# EAGLE design Modul1 (EAGLE 9.6.2)
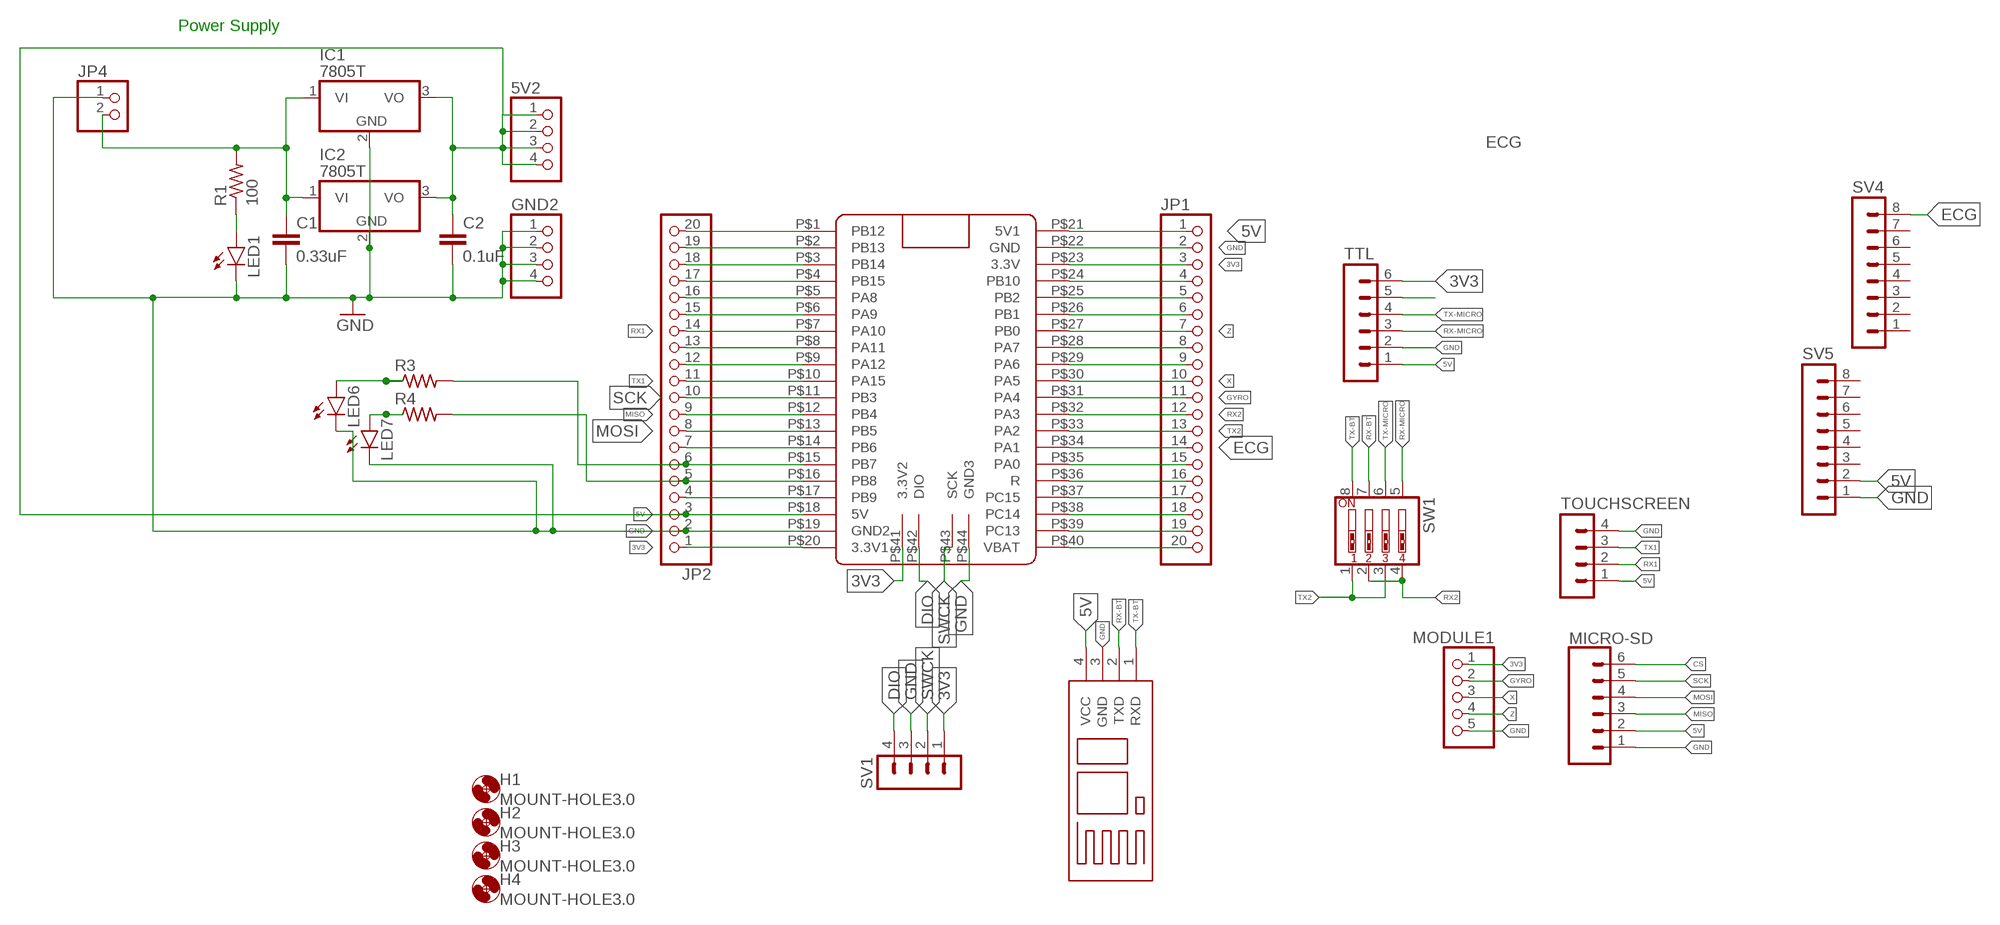
[diagram p0: schematic, sheet 1]

## Parts
5V2  PINHD-1X4  [1X04]
B3  BLUETOOTH  [BLUETOOTH]
C1  0.33uF  C-EU025-024X044  [C025-024X044]
C2  0.1uF  C-EU025-024X044  [C025-024X044]
GND2  PINHD-1X4  [1X04]
H1  MOUNT-HOLE3.0  [3,0]
H2  MOUNT-HOLE3.0  [3,0]
H3  MOUNT-HOLE3.0  [3,0]
H4  MOUNT-HOLE3.0  [3,0]
IC1  7805T  [TO220H]
IC2  7805T  [TO220H]
JP1  PINHD-1X20  [1X20]
JP2  PINHD-1X20  [1X20]
JP4  PINHD-1X2  [1X02]
LED1  LED5MM  [LED5MM]
LED6  LED5MM  [LED5MM]
LED7  LED5MM  [LED5MM]
MICRO-SD  CONN_06SILK_FEMALE_PTH  [1X06@1]
MODULE1  PINHD-1X5  [1X05]
R1  100  R-US_0204/5  [0204/5]
R3  R-US_0204/5  [0204/5]
R4  R-US_0204/5  [0204/5]
SV1  MA04-1  [MA04-1]
SV4  MA08-1  [MA08-1]
SV5  MA08-1  [MA08-1]
SW1  SW_DIP-4  [EDG-04]
TOUCHSCREEN  MA04-1  [MA04-1]
TTL  MA06-1  [MA06-1]
U$1  BLACKPILL  [BLACKPILL]

## Nets
3V3: JP1.3 JP2.1 MODULE1.1 SV1.1 TTL.6 U$1.P$20(3.3V1) U$1.P$23(3.3V) U$1.P$41(3.3V2)
5V: 5V2.1 5V2.2 5V2.3 5V2.4 B3.4(VCC) C2.1 IC1.3(VO) IC2.3(VO) JP1.1 JP2.3 MICRO-SD.2 SV5.2 TOUCHSCREEN.1 TTL.1 U$1.P$18(5V) U$1.P$21(5V1)
CS: MICRO-SD.6
DIO: SV1.4 U$1.P$42(DIO)
ECG: JP1.14 SV4.8 U$1.P$34(PA1)
GND: C1.2 C2.2 GND2.1 GND2.2 GND2.3 GND2.4 IC1.2(GND) IC2.2(GND) JP1.2 JP2.2 JP4.1 LED1.K(C) LED6.K(C) LED7.K(C) MICRO-SD.1 MODULE1.5 SV1.3 SV5.1 TOUCHSCREEN.4 TTL.2 U$1.P$19(GND2) U$1.P$22(GND) U$1.P$44(GND3)
GYRO: JP1.11 MODULE1.2 U$1.P$31(PA4)
MISO: JP2.9 MICRO-SD.3 U$1.P$12(PB4)
MOSI: JP2.8 MICRO-SD.4 U$1.P$13(PB5)
N$1: JP2.20 U$1.P$1(PB12)
N$2: JP2.19 U$1.P$2(PB13)
N$3: JP2.18 U$1.P$3(PB14)
N$4: C1.1 IC1.1(VI) IC2.1(VI) JP4.2 R1.2
N$5: JP1.8 U$1.P$28(PA7)
N$6: TTL.5
N$7: JP1.4 U$1.P$24(PB10)
N$8: LED1.A R1.1
N$9: JP2.12 U$1.P$9(PA12)
N$16: JP2.5 R4.2 U$1.P$16(PB8)
N$17: LED6.A R3.1
N$18: LED7.A R4.1
N$19: JP2.7 U$1.P$14(PB6)
N$21: JP1.20 U$1.P$40(VBAT)
N$22: JP1.19 U$1.P$39(PC13)
N$23: JP1.18 U$1.P$38(PC14)
N$24: JP1.17 U$1.P$37(PC15)
N$25: JP1.16 U$1.P$36(R)
N$30: JP1.5 U$1.P$25(PB2)
N$31: JP1.6 U$1.P$26(PB1)
N$40: JP1.15 U$1.P$35(PA0)
RX1: JP2.14 TOUCHSCREEN.2 U$1.P$7(PA10)
RX2: JP1.12 SW1.2 SW1.4 U$1.P$32(PA3)
RX-BT: B3.2(TXD) SW1.7
RX-MICRO: SW1.5 TTL.3
SCK: JP2.10 MICRO-SD.5 U$1.P$11(PB3)
SDA: JP2.4 U$1.P$17(PB9)
SDIO_CK: JP2.17 U$1.P$4(PB15)
SDIO_CMD: JP1.9 U$1.P$29(PA6)
SDIO_D0: JP2.6 R3.2 U$1.P$15(PB7)
SDIO_D1: JP2.16 U$1.P$5(PA8)
SDIO_D2: JP2.15 U$1.P$6(PA9)
SWCK: SV1.2 U$1.P$43(SCK)
TX1: JP2.11 TOUCHSCREEN.3 U$1.P$10(PA15)
TX2: JP1.13 SW1.1 SW1.3 U$1.P$33(PA2)
TX6: JP2.13 U$1.P$8(PA11)
TX-BT: B3.1(RXD) SW1.8
TX-MICRO: SW1.6 TTL.4
X: JP1.10 MODULE1.3 U$1.P$30(PA5)
Z: JP1.7 MODULE1.4 U$1.P$27(PB0)
Unconnected: SV4.1 SV4.2 SV4.3 SV4.4 SV4.5 SV4.6 SV4.7 SV5.3 SV5.4 SV5.5 SV5.6 SV5.7 SV5.8

## Notes on the sheet
- Power Supply
- ECG

## Power pins joined to a net without a drawn wire
GND: B3.3(GND)

## Library data of the parts
5V2 GND2 = pinhead:PINHD-1X4: PIN HEADER
B3 = Bluetooth:BLUETOOTH
C1 C2 = resistor:C-EU: CAPACITOR, European symbol
H1-H4 = holes:MOUNT-HOLE: MOUNTING HOLE with drill center marker
IC1 IC2 = linear:78*: Positive VOLTAGE REGULATOR Source: http://cache.national.com/ds/LM/LM78L05.pdf http://www.fairchildsemi.com/ds/LM/LM7805.pdf
JP1 JP2 = pinhead:PINHD-1X20: PIN HEADER
JP4 = pinhead:PINHD-1X2: PIN HEADER
LED1 LED6 LED7 = led:LED: LED OSRAM: - CHIPLED LG R971, LG N971, LY N971, LG Q971, LY Q971, LO R971, LY R971 LH N974, LH R974 LS Q976, LO Q976, LY Q976 LO Q996 - Hyper CHIPLED LW Q18S LB Q993, LB Q99A, LB R99A - SideLED LS A670, LO A670, LY A670, LG A670, LP A670 LB A673, LV A673, LT A673, LW A673 LH A674 LY A675 LS A676, LA A676, LO A676, LY A676, LW A676 LS A679, LY A679, LG A679 - Hyper Micro SIDELED® LS Y876, LA Y876, LO Y876, LY Y876 LT Y87S - SmartLED LW L88C, LW L88S LB L89C, LB L89S, LG L890 LS L89K, LO L89K, LY L89K LS L896, LA L896, LO L896, LY L896 - TOPLED LS T670, LO T670, LY T670, LG T670, LP T670 LSG T670, LSP T670, LSY T670, LOP T670, LYG T670 LG T671, LOG T671, LSG T671 LB T673, LV T673, LT T673, LW T673 LH T674 LS T676, LA T676, LO T676, LY T676, LB T676, LH T676, LSB T676, LW T676 LB T67C, LV T67C, LT T67C, LS T67K, LO T67K, LY T67K, LW E67C LS E67B, LA E67B, LO E67B, LY E67B, LB E67C, LV E67C, LT E67C LW T67C LS T679, LY T679, LG T679 LS T770, LO T770, LY T770, LG T770, LP T770 LB T773, LV T773, LT T773, LW T773 LH T774 LS E675, LA E675, LY E675, LS T675 LS T776, LA T776, LO T776, LY T776, LB T776 LHGB T686 LT T68C, LB T68C - Hyper Mini TOPLED® LB M676 - Mini TOPLED Santana® LG M470 LS M47K, LO M47K, LY M47K Source: http://www.osram.convergy.de LUXEON: - LUMILED® LXK2-PW12-R00, LXK2-PW12-S00, LXK2-PW14-U00, LXK2-PW14-V00 LXK2-PM12-R00, LXK2-PM12-S00, LXK2-PM14-U00 LXK2-PE12-Q00, LXK2-PE12-R00, LXK2-PE12-S00, LXK2-PE14-T00, LXK2-PE14-U00 LXK2-PB12-K00, LXK2-PB12-L00, LXK2-PB12-M00, LXK2-PB14-N00, LXK2-PB14-P00, LXK2-PB14-Q00 LXK2-PR12-L00, LXK2-PR12-M00, LXK2-PR14-Q00, LXK2-PR14-R00 LXK2-PD12-Q00, LXK2-PD12-R00, LXK2-PD12-S00 LXK2-PH12-R00, LXK2-PH12-S00 LXK2-PL12-P00, LXK2-PL12-Q00, LXK2-PL12-R00 Source: www.luxeon.com KINGBRIGHT: KA-3528ASYC Source: www.kingbright.com
MICRO-SD = SparkFun-Connectors:CONN_06: Multi connection point. Often used as Generic Header-pin footprint for 0.1 inch spaced/style header connections On any of the 0.1 inch spaced packages, you can populate with these: Break Away Headers - Straight <https://www.sparkfun.com/products/116> (PRT-00116) Break Away Male Headers - Right Angle <https://www.sparkfun.com/products/553> (PRT-00553) Female Headers <https://www.sparkfun.com/products/115> (PRT-00115) Break Away Headers - Machine Pin <https://www.sparkfun.com/products/117> (PRT-00117) Break Away Female Headers - Swiss Machine Pin <https://www.sparkfun.com/products/743> (PRT-00743) Arduino Stackable Header - 6 Pin <https://www.sparkfun.com/products/9280> (PRT-09280) For SCREWTERMINALS and SPRING TERMINALS visit here: Screw Terimnals on SparkFun.com <https://www.sparkfun.com/search/results?term=Screw+Terminals> (5mm/3.5mm/2.54mm spacing) This device is also useful as a general connection point to wire up your design to another part of your project. Our various solder wires solder well into these plated through hole pads. Hook-Up Wire - Assortment (Stranded, 22 AWG) <https://www.sparkfun.com/products/11375> (PRT-11375) Hook-Up Wire - Assortment (Solid Core, 22 AWG) <https://www.sparkfun.com/products/11367> (PRT-11367) View the entire wire category on our website here <https://www.sparkfun.com/categories/141>; PROD_ID: CONN-08437
MODULE1 = pinhead:PINHD-1X5: PIN HEADER
R1 R3 R4 = resistor:R-US_: RESISTOR, American symbol
SV1 TOUCHSCREEN = con-lstb:MA04-1: PIN HEADER; OC_FARNELL: unknown; OC_NEWARK: unknown
SV4 SV5 = con-lstb:MA08-1: PIN HEADER; OC_FARNELL: unknown; OC_NEWARK: unknown
SW1 = special:SW_DIP-4: DIP SWITCH
TTL = con-lstb:MA06-1: PIN HEADER; OC_FARNELL: unknown; OC_NEWARK: unknown
U$1 = BluePill:BLACKPILL

## Net classes
0 default: width 0.813 mm

## Board
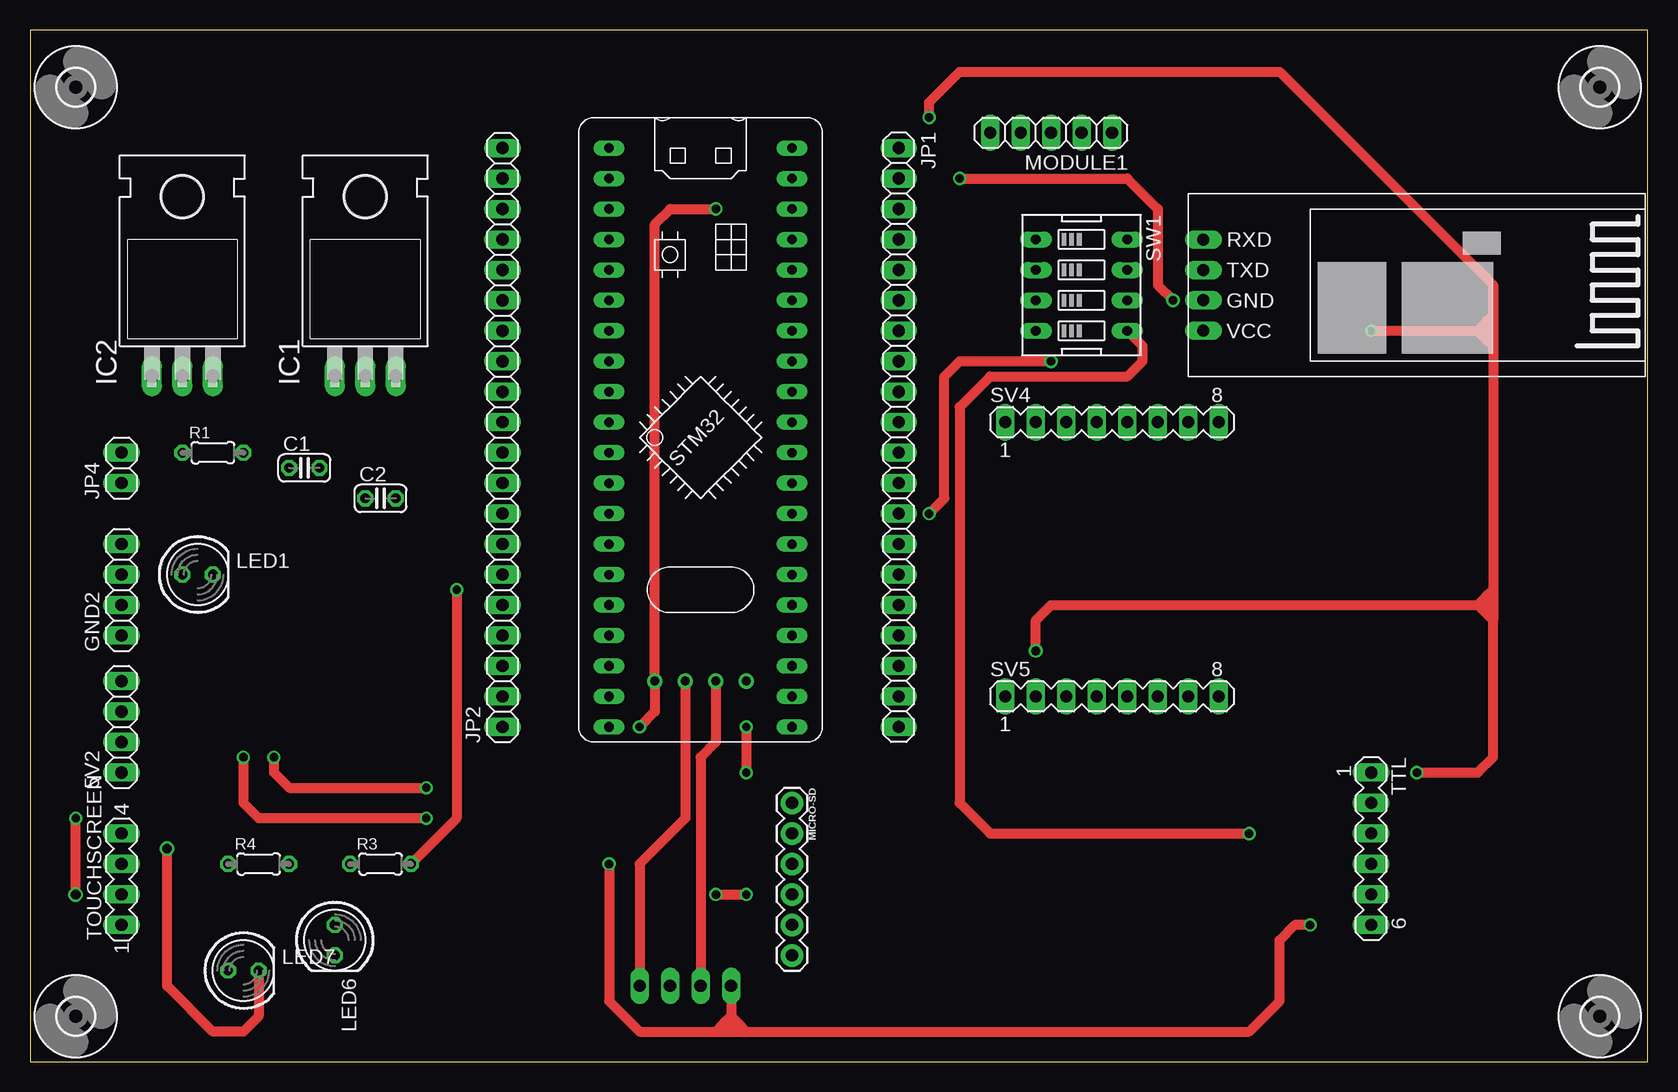
[diagram p1: board, top side]
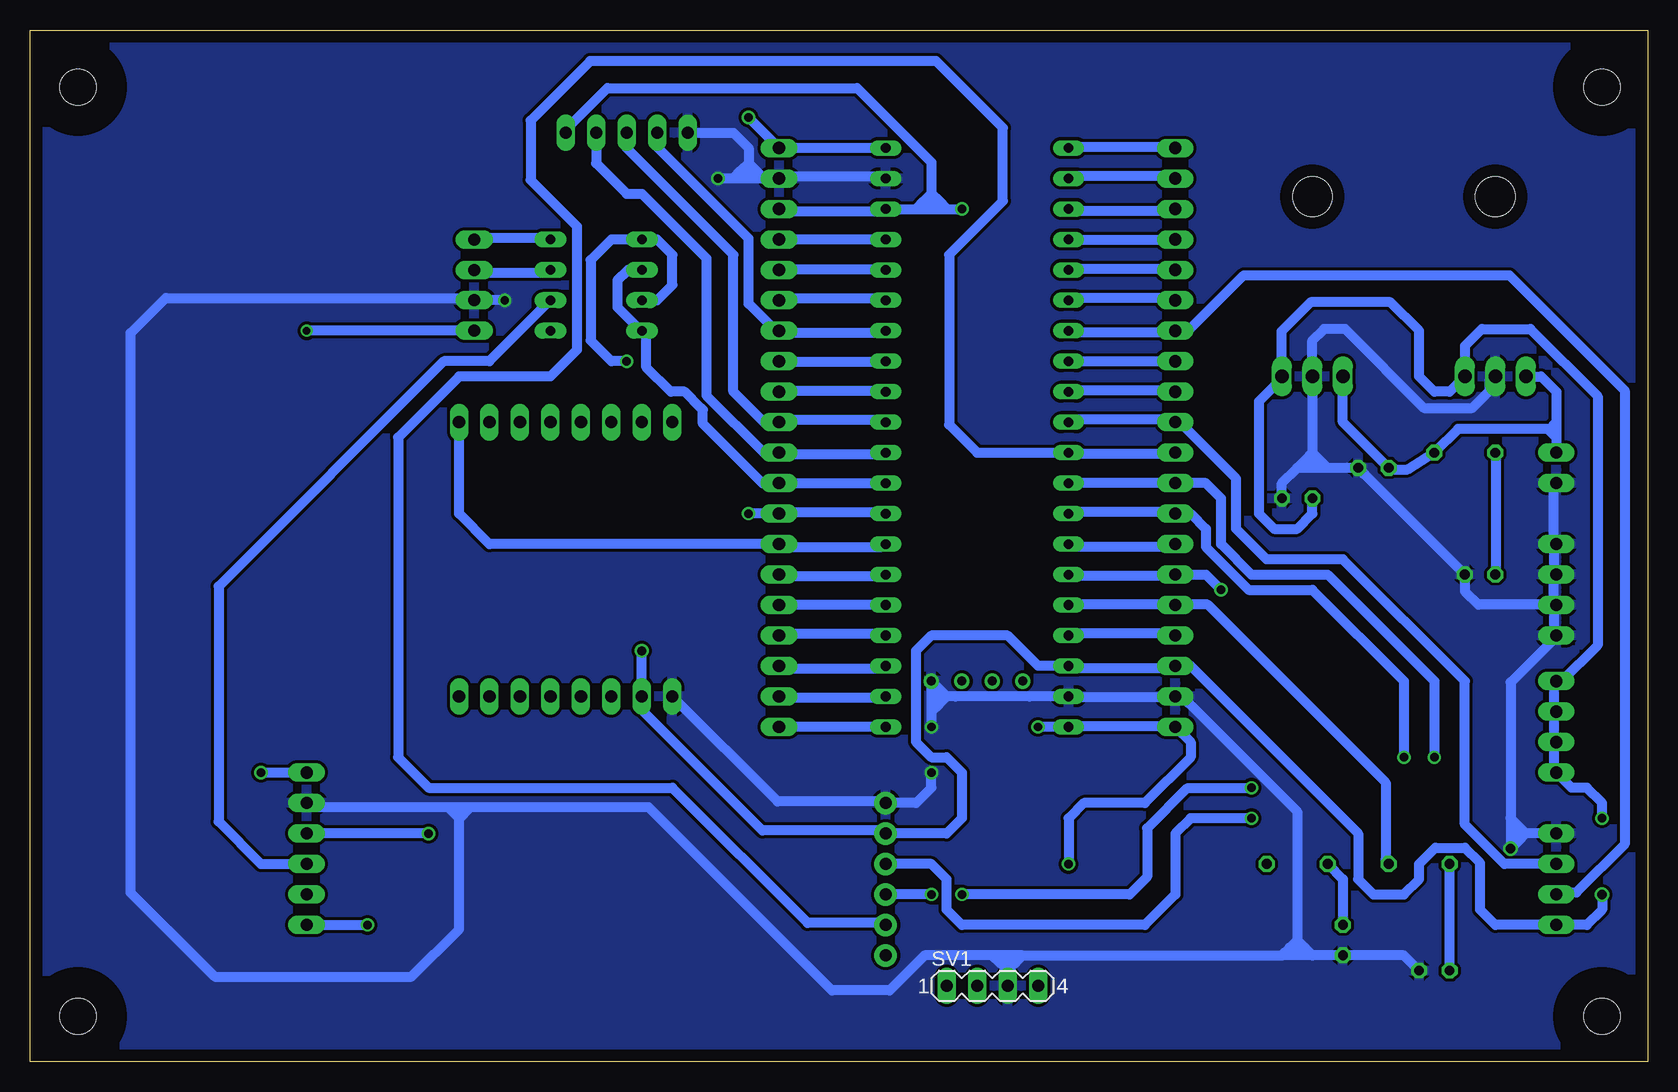
[diagram p2: board, bottom side, seen from below]

Size 134.81 x 86.04 mm. Coordinates in mm from the lower left corner, seen from the top.
Outline: 0,0 134.81,0 134.81,86.04 0,86.03 0,0
Copper layers (1*16): Top 0.035mm / dielectric 1.5mm / Bottom 0.035mm
Design rules "default *": minimum track width 10mil, minimum drill 0.6mm, track to track 10mil, track to pad 10mil, pad to pad 10mil, via to via 10mil, smd to smd 10mil, copper to edge 40mil, drill to drill 6mil, minimum pad ring 10mil, minimum via ring 8mil, stop-mask expansion 4mil, vias tented up to drill 0mil, thermal gap 10mil

### Footprints (pad centres in the part's own frame; a part is rotated, then mirrored left to right if it is on the bottom)
1X04 = drill 1.016 long: 1 -3.81,0; 2 -1.27,0; 3 1.27,0; 4 3.81,0
BLUETOOTH = drill 1 pad 1.549 long: 1 -6.35,3.81; 2 -6.35,1.27; 3 -6.35,-1.27; 4 -6.35,-3.81
C025-024X044 = drill 0.813 octagon: 1 -1.27,0; 2 1.27,0
3,0 = hole 3: 0,0
TO220H = drill 1.118 long: 1 -2.54,-10.16; 2 0,-10.16; 3 2.54,-10.16 | hole 3.302: 0,4.826
1X20 = drill 1.016 long: 1 -24.13,0; 2 -21.59,0; 3 -19.05,0; 4 -16.51,0; 5 -13.97,0; 6 -11.43,0; 7 -8.89,0; 8 -6.35,0; 9 -3.81,0; 10 -1.27,0; 11 1.27,0; 12 3.81,0; 13 6.35,0; 14 8.89,0; 15 11.43,0; 16 13.97,0; 17 16.51,0; 18 19.05,0; 19 21.59,0; 20 24.13,0
1X02 = drill 1.016 long: 1 -1.27,0; 2 1.27,0
LED5MM = drill 0.813 octagon: A -1.27,0; K 1.27,0
1X06@1 = drill 1.016 pad 1.88: 1 0,0; 2 2.54,0; 3 5.08,0; 4 7.62,0; 5 10.16,0; 6 12.7,0
1X05 = drill 1.016 long: 1 -5.08,0; 2 -2.54,0; 3 0,0; 4 2.54,0; 5 5.08,0
0204/5 = drill 0.813 octagon: 1 -2.54,0; 2 2.54,0
MA04-1 = drill 1.016 long: 1 -3.81,0; 2 -1.27,0; 3 1.27,0; 4 3.81,0
MA08-1 = drill 1.016 long: 1 -8.89,0; 2 -6.35,0; 3 -3.81,0; 4 -1.27,0; 5 1.27,0; 6 3.81,0; 7 6.35,0; 8 8.89,0
EDG-04 = drill 0.813 long: 1 -3.81,-3.81; 2 -1.27,-3.81; 3 1.27,-3.81; 4 3.81,-3.81; 5 3.81,3.81; 6 1.27,3.81; 7 -1.27,3.81; 8 -3.81,3.81
MA06-1 = drill 1.016 long: 1 -6.35,0; 2 -3.81,0; 3 -1.27,0; 4 1.27,0; 5 3.81,0; 6 6.35,0
BLACKPILL = drill 0.8 long: P$1 -7.62,15.24; P$2 -7.62,12.7; P$3 -7.62,10.16; P$4 -7.62,7.62; P$5 -7.62,5.08; P$6 -7.62,2.54; P$7 -7.62,0; P$8 -7.62,-2.54; P$9 -7.62,-5.08; P$10 -7.62,-7.62; P$11 -7.62,-10.16; P$12 -7.62,-12.7; P$13 -7.62,-15.24; P$14 -7.62,-17.78; P$15 -7.62,-20.32; P$16 -7.62,-22.86; P$17 -7.62,-25.4; P$18 -7.62,-27.94; P$19 -7.62,-30.48; P$20 -7.62,-33.02; P$21 7.62,15.24; P$22 7.62,12.7; P$23 7.62,10.16; P$24 7.62,7.62; P$25 7.62,5.08; P$26 7.62,2.54; P$27 7.62,0; P$28 7.62,-2.54; P$29 7.62,-5.08; P$30 7.62,-7.62; P$31 7.62,-10.16; P$32 7.62,-12.7; P$33 7.62,-15.24; P$34 7.62,-17.78; P$35 7.62,-20.32; P$36 7.62,-22.86; P$37 7.62,-25.4; P$38 7.62,-27.94; P$39 7.62,-30.48; P$40 7.62,-33.02 | drill 0.75: P$41 -3.81,-29.21; P$42 -1.27,-29.21; P$43 1.27,-29.21; P$44 3.81,-29.21

### Placement (x,y rotation side)
5V2  7.62,27.94 90 top
B3  104.14,64.77 0 top
C1  22.86,49.53 0 top
C2  29.21,46.99 0 top
GND2  7.62,39.37 90 top
H1  3.81,3.81 0 top
H2  3.81,81.28 0 top
H3  130.81,3.81 0 top
H4  130.81,81.28 0 top
IC1  27.94,67.31 0 top
IC2  12.7,67.31 0 top
JP1  72.39,52.07 270 top
JP2  39.37,52.07 90 top
JP4  7.62,49.53 90 top
LED1  13.97,40.64 0 top
LED6  25.4,10.16 270 top
LED7  17.78,7.62 0 top
MICRO-SD  63.5,21.59 270 top
MODULE1  85.09,77.47 180 top
R1  15.24,50.8 0 top
R3  29.21,16.51 0 top
R4  19.05,16.51 0 top
SV1  54.61,6.35 0 bottom
SV4  90.17,53.34 0 top
SV5  90.17,30.48 0 top
SW1  87.63,64.77 270 top
TOUCHSCREEN  7.62,15.24 90 top
TTL  111.76,17.78 270 top
U$1  55.88,60.96 0 top

### Tracks (layer width: path | path; a pad name or v marks a point on that pad's centre or on a via)
3V3  (via drill 0.7 pad 0.7)
  Top 0.813: v48.26,16.51 48.26,5.08 50.8,2.54 57.15,2.54 | 57.15,2.54 59.69,2.54 | 59.69,2.54 101.6,2.54 104.14,5.08 104.14,10.16 105.41,11.43 v106.68,11.43 | v50.8,27.94 52.07,29.21 U$1.P$41 52.07,69.85 53.34,71.12 v57.15,71.12 | SV1.1 58.42,3.81 | 57.15,2.54 57.78,3.17 | 57.78,3.17 58.42,3.81 | 58.42,3.81 59.05,3.17 | 57.78,3.17 59.05,3.17 | 59.05,3.17 59.69,2.54
  Bottom 0.813: JP1.3 72.03,70.94 63.83,70.94 U$1.P$23 60.96,71.12 | MODULE1.1 89.89,77.52 89.89,78 86.69,81.2 65.89,81.2 59.69,75.01 59.69,72.39 | TTL.6 v106.68,11.43 | v50.8,27.94 U$1.P$20 47.9,27.99 39.7,27.99 JP2.1 38.1,26.67 38.1,25.4 41.91,21.59 46.99,21.59 48.26,20.32 v48.26,16.51 | 60.96,71.12 58.42,71.12 | 58.42,71.12 v57.15,71.12 | 59.69,72.39 59.05,71.75 | 59.69,72.39 60.33,71.75 | 60.33,71.75 60.96,71.12 | 58.42,71.12 59.05,71.75 | 59.05,71.75 60.33,71.75
5V  (via drill 0.6 pad 0.65, 0.7 pad 0.7, 0.75 pad 0.75, 0.8 pad 0.8)
  Top 0.813: v3.81,13.97 v3.81,20.32 | 121.92,39.37 121.92,36.83 | v115.57,24.13 120.65,24.13 121.92,25.4 121.92,36.83 | v74.93,78.74 74.93,80.01 77.47,82.55 104.14,82.55 121.92,64.77 121.92,62.23 | v83.82,34.29 83.82,36.83 85.09,38.1 120.65,38.1 | 120.65,38.1 121.28,38.73 | 121.28,38.73 121.92,39.37 | 120.65,38.1 121.28,37.47 | 121.28,37.47 121.92,36.83 | 121.28,38.73 121.28,37.47 | v111.76,60.96 120.65,60.96 | 120.65,60.96 121.28,60.33 | 121.28,60.33 121.92,59.69 | 121.92,59.69 121.92,39.37 | 120.65,60.96 121.28,61.59 | 121.28,61.59 121.92,62.23 | 121.92,62.23 121.92,59.69 | 121.28,61.59 121.28,60.33
  Bottom 0.813: 30.53,56.95 32.41,55.07 32.41,45.72 31.14,44.45 29.21,44.45 27.94,45.72 C2.1 | 30.53,56.95 IC1.3 | v83.82,34.29 SV5.2 83.82,29.34 73.79,19.3 63.83,19.3 MICRO-SD.2 58.42,19.05 57.15,20.32 57.15,24.13 58.42,25.4 59.69,25.4 60.98,26.69 60.98,34.27 59.69,35.56 53.34,35.56 50.8,33.02 U$1.P$18 47.9,32.82 39.7,32.82 JP2.3 38.1,33.02 24.13,19.05 24.13,15.24 22.86,13.97 20.32,13.97 19.05,15.24 19.05,16.51 17.7,17.86 15.24,17.86 13.97,16.59 13.97,12.7 12.7,11.43 TOUCHSCREEN.1 5.08,11.43 3.81,12.7 v3.81,13.97 | v115.57,24.13 TTL.1 | v3.81,20.32 3.81,21.59 5.08,22.86 6.35,22.86 5V2.1 7.85,24.13 7.85,26.54 5V2.2 7.85,27.03 7.85,28.96 5V2.3 7.85,29.44 7.85,31.37 5V2.4 7.16,31.75 4.17,34.75 4.17,55.5 9.78,61.11 13.82,61.11 15.24,59.69 IC2.3 16.51,55.88 17.78,55.88 19.05,57.15 19.05,60.96 21.44,63.35 28.09,63.35 30.53,60.91 30.53,56.95 | U$1.P$21 JP1.1 v74.93,78.74 | B3.4 v111.76,60.96
DIO
  Top 0.813: U$1.P$42 54.61,20.32 50.8,16.51 SV1.4
ECG
  Bottom 0.813: U$1.P$34 63.83,42.95 72.03,42.95 JP1.14 96.52,43.18 99.06,45.72 SV4.8
GND  (via drill 0.7 pad 0.7, 0.8 pad 0.8)
  Top 0.813: LED7.K 19.05,3.81 17.78,2.54 15.24,2.54 11.43,6.35 v11.43,17.78 | v77.47,73.66 91.44,73.66 93.98,71.12 93.98,64.77 v95.25,63.5 | v59.69,27.94 v59.69,24.13
  Bottom 0.813: 52.07,8.89 30.48,8.89 | 98.15,21.23 83.26,21.23 68,5.97 63.17,5.97 60.25,8.89 54.61,8.89 | 98.15,21.23 99.97,21.23 | 99.97,21.23 111.61,21.23 TTL.2 | IC2.2 13.16,56.95 13.16,55.98 14.61,54.53 18.64,54.53 25.22,61.11 26.98,61.11 27.94,60.15 IC1.2 27.94,50.8 | 11.43,20.32 11.43,31.65 7.85,35.23 GND2.1 7.85,35.71 7.85,37.64 GND2.2 7.85,38.12 | JP4.1 7.85,48.26 7.85,43.43 GND2.4 7.85,42.95 7.85,41.02 GND2.3 7.85,40.54 7.85,38.12 | 7.85,38.12 14.12,38.12 15.24,39.24 LED1.K 23.62,49.02 23.77,49.12 23.77,49.23 C1.2 26.67,49.53 | U$1.P$22 63.83,73.84 72.03,73.84 JP1.2 73.66,73.66 | SV5.1 72.52,21.72 63.83,21.72 MICRO-SD.1 60.96,21.59 59.69,22.86 v59.69,24.13 | v95.25,63.5 B3.3 97.99,63.7 123.5,63.7 126.42,60.78 126.42,14.12 119.41,7.11 103.02,7.11 99.06,11.07 99.06,20.32 | 73.66,73.66 76.2,73.66 | 76.2,73.66 v77.47,73.66 | 10.16,19.05 10.79,18.41 | 10.79,18.41 v11.43,17.78 11.43,20.32 | 27.94,50.8 27.3,50.16 | 26.67,49.53 27.3,50.16 | 29.21,49.53 30.48,48.26 C2.2 | 29.21,49.53 28.57,50.16 | 28.57,50.16 27.94,50.8 | 27.3,50.16 28.57,50.16 | 26.67,49.53 29.21,49.53 | 58.42,30.48 57.7,30.48 57.68,30.46 51.54,30.46 51.52,30.48 U$1.P$19 47.9,30.4 39.7,30.4 JP2.2 38.25,29.92 29.21,20.88 29.21,10.16 | 59.05,31.11 U$1.P$44 59.69,29.21 | 59.05,31.11 58.42,30.48 | 58.42,30.48 59.05,29.84 | 59.05,29.84 59.69,29.21 | 59.69,29.21 v59.69,27.94 | 59.05,31.11 59.05,29.84 | 52.07,8.89 52.7,8.26 | 52.7,8.26 53.34,7.62 | SV1.3 53.34,7.62 | 53.34,7.62 53.98,8.26 | 53.98,8.26 54.61,8.89 | 52.07,8.89 54.61,8.89 | 53.98,8.26 52.7,8.26 | 99.06,20.32 98.15,21.23 | 99.06,20.32 99.97,21.23 | MODULE1.5 76.2,77.47 74.93,76.2 74.93,74.93
  Bottom 0.813: 74.93,74.93 74.3,74.3 | 74.3,74.3 73.66,73.66 | 74.93,74.93 75.56,74.3 | 75.56,74.3 76.2,73.66 | 74.3,74.3 75.56,74.3 | LED7.K 20.32,8.89 LED6.K 27.94,8.89 | 27.94,8.89 30.48,8.89 | 29.21,10.16 29.84,9.53 | 29.21,10.16 28.57,9.53 | 28.57,9.53 27.94,8.89 | 28.57,9.53 29.84,9.53 | 29.84,9.53 30.48,8.89 | 10.16,19.05 10.79,19.68 | 10.79,19.68 11.43,20.32 | 10.79,19.68 10.79,18.41 | TOUCHSCREEN.4 10.16,19.05
  pour Bottom: -1.27,87.63 -1.27,-2.54 137.16,-2.54 137.16,87.63
GYRO
  Bottom 0.813: U$1.P$31 63.83,50.67 72.03,50.67 JP1.11 73.66,50.8 78.44,55.58 78.44,67 83.82,72.39 85.09,72.39 87.63,74.93 87.63,77.34 87.56,77.4 MODULE1.2
MISO  (via drill 0.7 pad 0.7)
  Top 0.813: v17.78,25.4 17.78,21.59 19.05,20.32 v33.02,20.32
  Bottom 0.813: v17.78,25.4 17.78,31.75 26.67,40.64 33.02,40.64 35.56,43.18 35.56,46.99 36.83,48.26 JP2.9 U$1.P$12 | v33.02,20.32 38.1,20.32 39.37,19.05 39.37,13.97 41.91,11.43 57.15,11.43 58.42,12.7 58.42,15.24 59.69,16.51 MICRO-SD.3
MOSI  (via drill 0.7 pad 0.7)
  Top 0.813: v20.32,25.4 20.32,24.13 21.59,22.86 v33.02,22.86 | v57.15,13.97 v59.69,13.97
  Bottom 0.813: U$1.P$13 47.9,45.85 39.7,45.85 JP2.8 38.1,45.72 36.83,44.45 36.83,42.94 33.26,39.37 27.94,39.37 20.32,31.75 v20.32,25.4 | v33.02,22.86 33.08,22.8 38.4,22.8 41.71,19.49 41.71,15.44 43.18,13.97 v57.15,13.97 | v59.69,13.97 MICRO-SD.4
N$1
  Bottom 0.813: U$1.P$1 47.9,76.25 39.7,76.25 JP2.20
N$2
  Bottom 0.813: U$1.P$2 47.9,73.84 39.7,73.84 JP2.19
N$3
  Bottom 0.813: U$1.P$3 47.9,70.94 39.7,70.94 JP2.18
N$4
  Bottom 0.813: 8.26,52.7 8.33,52.78 15.8,52.78 R1.2 20.02,49.4 21.46,49.4 C1.1 25.4,53.34 IC1.1 | 8.26,52.7 7.62,52.07 JP4.2 7.62,53.34 | 7.62,53.34 7.62,55.88 8.89,57.15 IC2.1 | 8.26,52.7 7.62,53.34
N$5
  Bottom 0.813: U$1.P$28 63.83,58.4 72.03,58.4 JP1.8
N$7
  Bottom 0.813: U$1.P$24 JP1.4
N$8
  Bottom 0.813: LED1.A 12.68,40.84 12.68,50.67 R1.1
N$9
  Bottom 0.813: U$1.P$9 47.9,55.98 39.7,55.98 JP2.12
N$16
  Bottom 0.813: U$1.P$16 47.9,38.12 39.7,38.12 JP2.5 39.34,38.12 36.68,38.12 21.84,23.29 21.84,16.89 R4.2
N$17
  Bottom 0.813: R3.1 25.4,15.24 LED6.A
N$18
  Bottom 0.813: LED7.A 16.54,7.72 16.54,16.41 R4.1
N$19
  Bottom 0.813: U$1.P$14 47.9,42.95 39.7,42.95 JP2.7
N$21
  Bottom 0.813: U$1.P$40 63.83,27.99 72.03,27.99 JP1.20
N$22
  Bottom 0.813: U$1.P$39 63.83,30.4 72.03,30.4 JP1.19
N$23
  Bottom 0.813: U$1.P$38 63.83,32.82 72.03,32.82 JP1.18
N$24
  Bottom 0.813: U$1.P$37 63.83,35.71 72.03,35.71 JP1.17
N$25
  Bottom 0.813: U$1.P$36 63.83,38.12 72.03,38.12 JP1.16
N$30
  Bottom 0.813: U$1.P$25 63.83,66.12 72.03,66.12 JP1.5
N$31
  Bottom 0.813: U$1.P$26 63.83,63.7 72.03,63.7 JP1.6
N$40
  Bottom 0.813: U$1.P$35 63.83,40.54 72.03,40.54 JP1.15
RX1
  Bottom 0.813: U$1.P$7 47.9,60.81 39.7,60.81 JP2.14 38.28,60.96 33.66,65.58 11.53,65.58 1.93,55.98 1.93,18.16 5.96,14.14 TOUCHSCREEN.2
RX2
  Bottom 0.813: SW1.2 84.96,66.04 85.85,65.15 85.85,62.92 83.92,60.98 SW1.4 83.44,60.5 83.44,57.91 81.41,55.88 80.25,55.88 78.86,54.49 78.74,54.37 78.74,53.21 73.79,48.26 JP1.12 U$1.P$32
RX-BT
  Bottom 0.813: SW1.7 91.64,65.81 97.43,65.81 B3.2
RX-MICRO  (via drill 0.7 pad 0.7)
  Top 0.813: SW1.5 92.71,59.69 92.71,58.42 91.44,57.15 80.01,57.15 77.47,54.61 77.47,21.59 80.01,19.05 v101.6,19.05
  Bottom 0.813: v101.6,19.05 TTL.3
SCK
  Bottom 0.813: MICRO-SD.5 63.83,11.58 70,11.58 81.28,22.86 101.6,22.86 104.14,25.4 104.14,52.07 99.06,57.15 91.44,57.15 89.23,59.36 89.23,69.67 93.09,73.53 93.09,78.49 88.14,83.44 59.31,83.44 53.75,77.88 53.75,71.78 58.22,67.31 58.22,53.14 55.88,50.8 U$1.P$11 47.9,50.67 39.7,50.67 JP2.10
SDA
  Bottom 0.813: U$1.P$17 47.9,35.71 39.7,35.71 JP2.4
SDIO_CK
  Bottom 0.813: U$1.P$4 47.9,68.53 39.7,68.53 JP2.17
SDIO_CMD
  Bottom 0.813: U$1.P$29 63.83,55.98 72.03,55.98 JP1.9
SDIO_D0  (via drill 0.7 pad 0.7)
  Top 0.813: v35.56,39.37 35.56,20.32 R3.2
  Bottom 0.813: U$1.P$15 47.9,40.54 39.7,40.54 JP2.6 36.83,40.64 v35.56,39.37
SDIO_D1
  Bottom 0.813: U$1.P$5 47.9,66.12 39.7,66.12 JP2.16
SDIO_D2
  Bottom 0.813: U$1.P$6 47.9,63.7 39.7,63.7 JP2.15
SWCK
  Top 0.813: SV1.2 55.88,25.4 57.15,26.67 U$1.P$43
TX1
  Bottom 0.813: U$1.P$10 47.9,53.57 39.7,53.57 JP2.11 39.22,53.57 34.29,48.64 34.29,44.45 31.75,41.91 25.4,41.91 15.24,31.75 15.24,19.8 11.95,16.51 TOUCHSCREEN.3
TX2  (via drill 0.7 pad 0.7)
  Top 0.813: v85.09,58.42 77.47,58.42 76.2,57.15 76.2,46.99 v74.93,45.72
  Bottom 0.813: U$1.P$33 63.83,45.85 72.03,45.85 JP1.13 v74.93,45.72 | v85.09,58.42 86.36,58.42 88.09,60.15 88.09,66.85 86.36,68.58 SW1.1 82.55,68.58 81.28,67.31 81.28,64.77 82.55,63.5 SW1.3
TX6
  Bottom 0.813: U$1.P$8 47.9,58.4 39.7,58.4 JP2.13
TX-BT
  Bottom 0.813: SW1.8 91.64,68.71 97.43,68.71 B3.1
TX-MICRO
  Bottom 0.813: SW1.6 96.52,58.42 100.33,58.42 119.1,39.65 119.1,20.04 115.57,16.51 TTL.4
X
  Bottom 0.813: U$1.P$30 63.83,53.57 72.03,53.57 JP1.10 73.66,53.34 76.2,55.88 76.2,67.31 85.09,76.2 MODULE1.3
Z
  Bottom 0.813: U$1.P$27 63.83,60.81 72.03,60.81 JP1.7 72.52,60.81 74.93,63.22 74.93,68.66 82.55,76.28 MODULE1.4